# Altium schematic sheet 05_8MPLUS_CFG.SchDoc: 8MPLUS_CFG
size 420 x 297 mm; Author: Lukas Henkel; DocumentNumber: 5; SheetNumber: 5; SheetTotal: 16; DocSize: A3
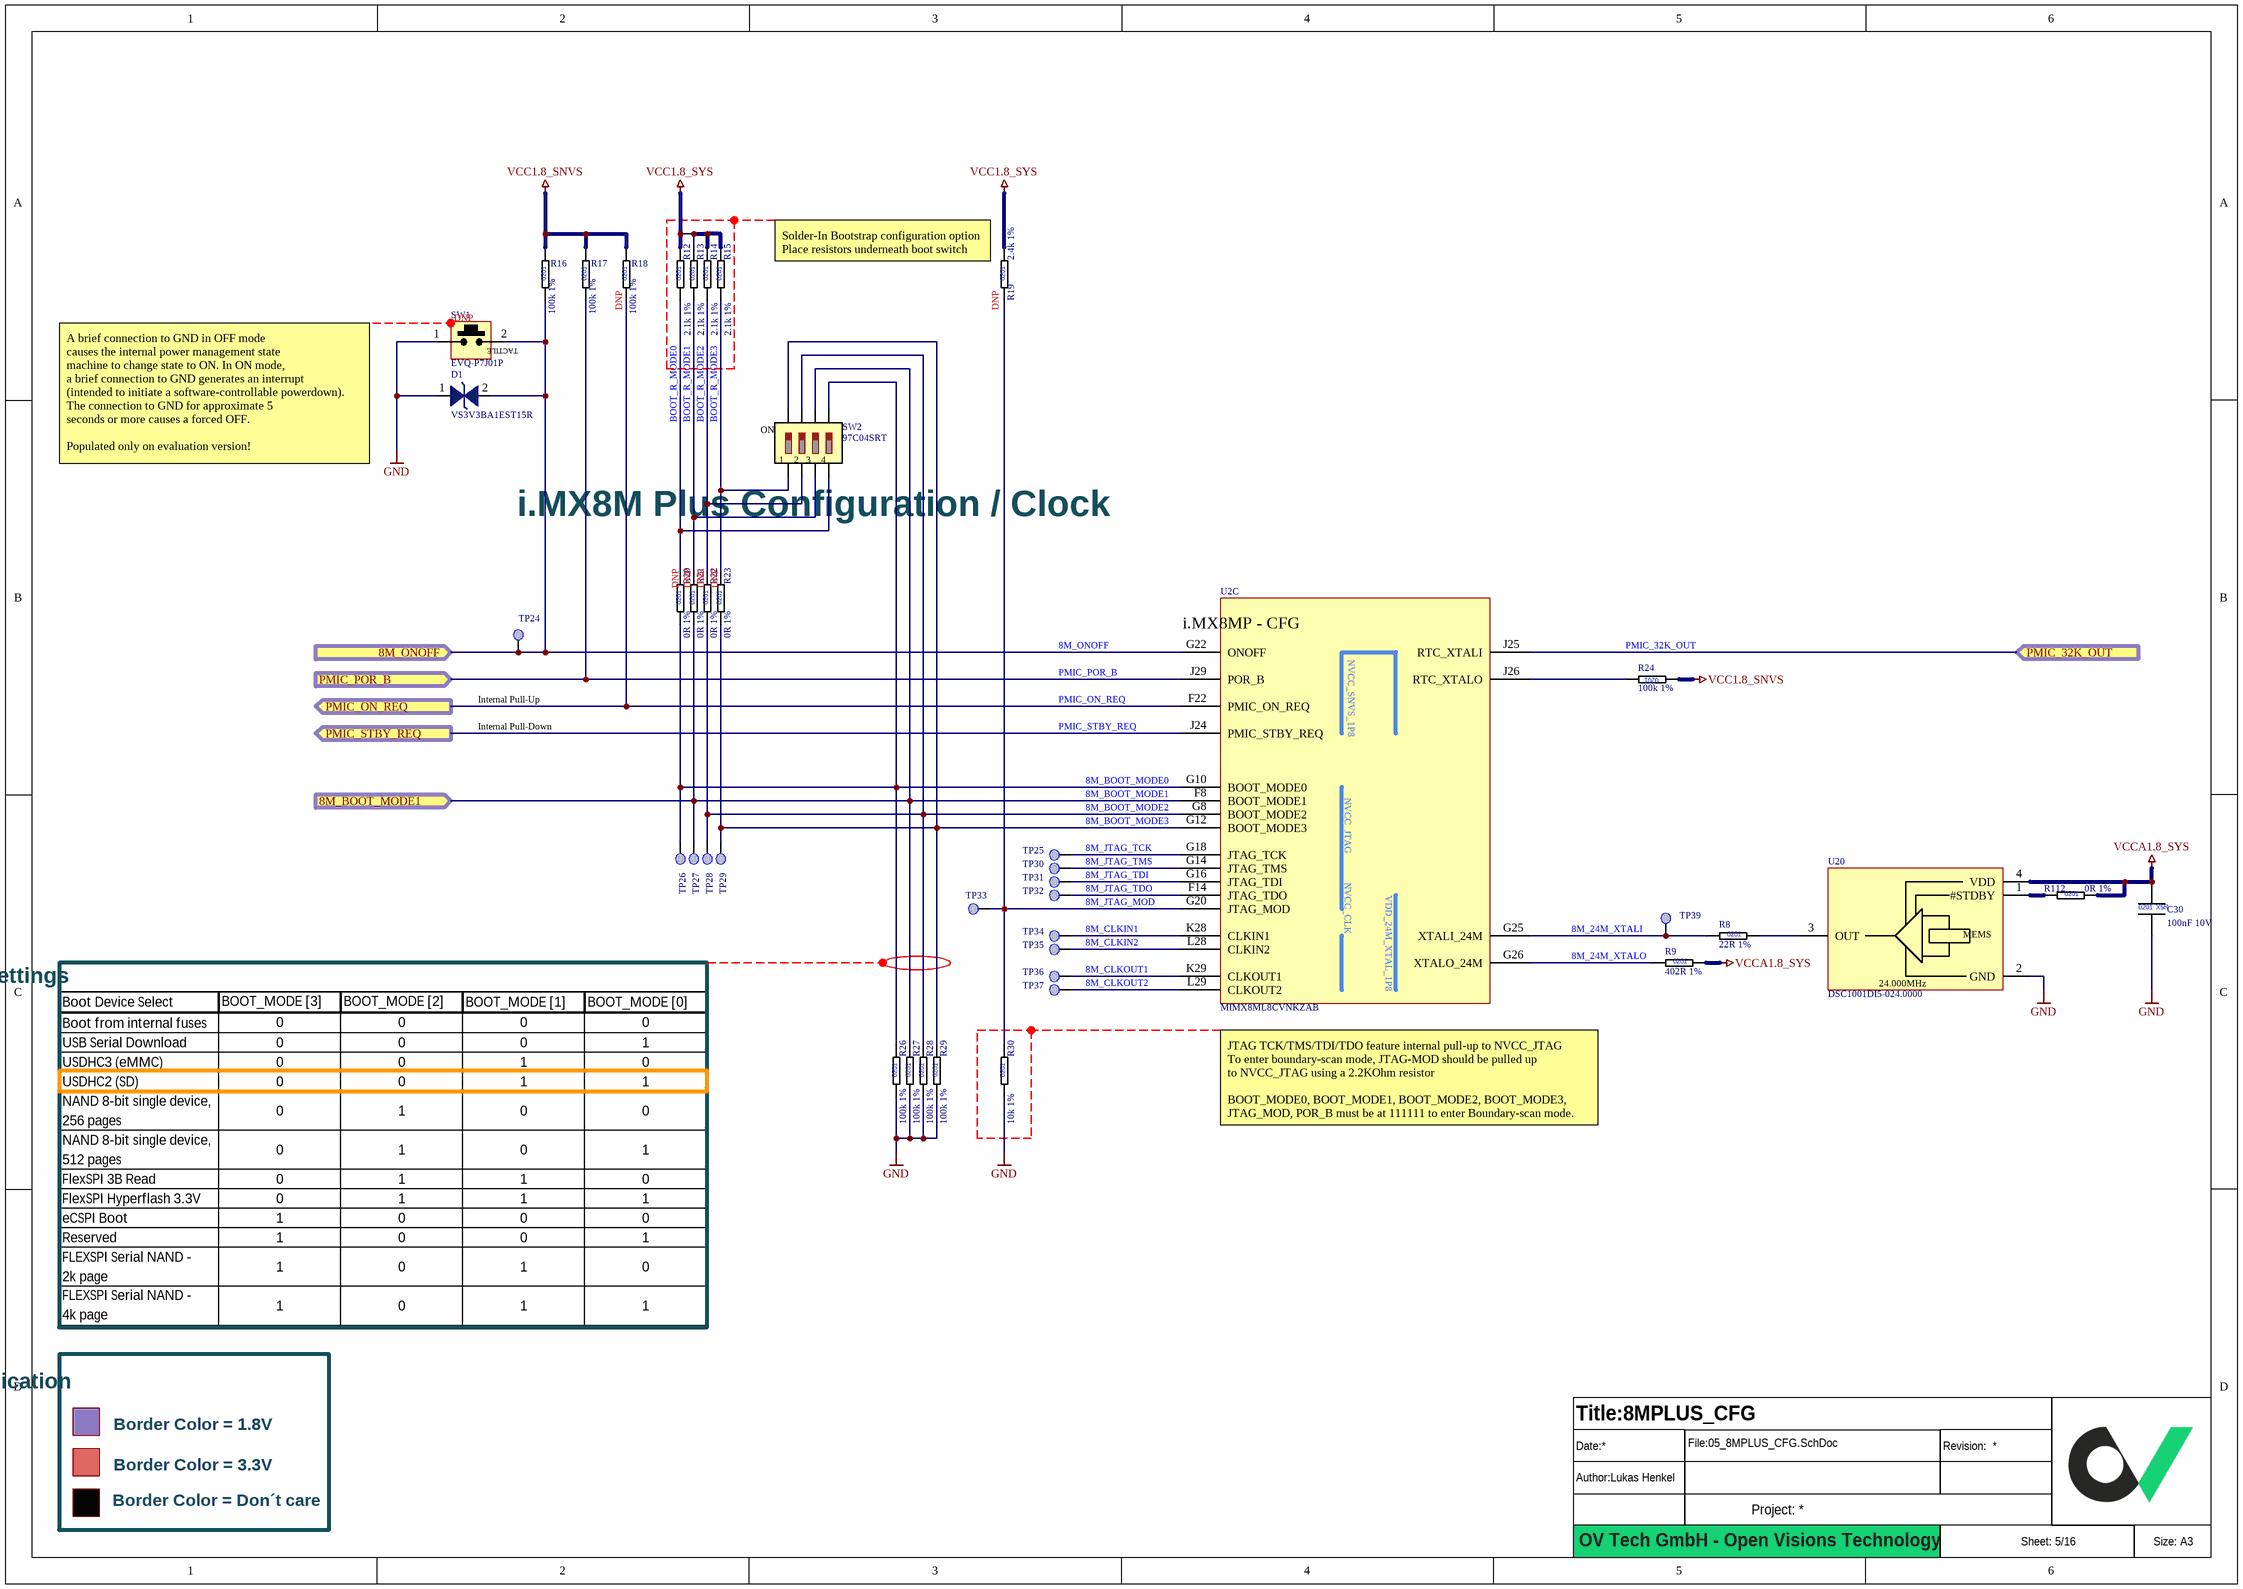
[diagram p0: 05_8MPLUS_CFG.SchDoc]

## Parts
?  (no value)  (graphical)
C30  100nF 10V  [CAPC0603X03L]
D1  VS3V3BA1EST15R  [DFN38P60X29-2L]
R8  22R 1%  [RESC0603X03L]
R9  402R 1%  [RESC0603X03L]
R12  2.1k 1%  [RESC0603X03L]
R13  2.1k 1%  [RESC0603X03L]
R14  2.1k 1%  [RESC0603X03L]
R15  2.1k 1%  [RESC0603X03L]
R16  100k 1%  [RESC0603X03L]
R17  100k 1%  [RESC0603X03L]
R18  100k 1%  [RESC0603X03L]
R19  2.4k 1%  [RESC0603X03L]  (no BOM)
R20  0R 1%  [RESC0603X03L]
R21  0R 1%  [RESC0603X03L]
R22  0R 1%  [RESC0603X03L]
R23  0R 1%  [RESC0603X03L]
R24  100k 1%  [RESC0603X03L]
R26  100k 1%  [RESC0603X03L]
R27  100k 1%  [RESC0603X03L]
R28  100k 1%  [RESC0603X03L]
R29  100k 1%  [RESC0603X03L]
R30  10k 1%  [RESC0603X03L]
R112  0R 1%  [RESC0603X03L]
SW1  EVQ-P7J01P  [SW_TACT_EVQ-P7J01P]
SW2  97C04SRT  [SW_DIP_4POL_97C04SRT]
TP24  Testpoint 0.5mm  [TP_0.50mm]  (value not drawn)  (no BOM)
TP25  Testpoint 0.5mm  [TP_0.50mm]  (value not drawn)  (no BOM)
TP26  Testpoint 0.5mm  [TP_0.50mm]  (value not drawn)  (no BOM)
TP27  Testpoint 0.5mm  [TP_0.50mm]  (value not drawn)  (no BOM)
TP28  Testpoint 0.5mm  [TP_0.50mm]  (value not drawn)  (no BOM)
TP29  Testpoint 0.5mm  [TP_0.50mm]  (value not drawn)  (no BOM)
TP30  Testpoint 0.5mm  [TP_0.50mm]  (value not drawn)  (no BOM)
TP31  Testpoint 0.5mm  [TP_0.50mm]  (value not drawn)  (no BOM)
TP32  Testpoint 0.5mm  [TP_0.50mm]  (value not drawn)  (no BOM)
TP33  Testpoint 0.5mm  [TP_0.50mm]  (value not drawn)  (no BOM)
TP34  Testpoint 0.5mm  [TP_0.50mm]  (value not drawn)  (no BOM)
TP35  Testpoint 0.5mm  [TP_0.50mm]  (value not drawn)  (no BOM)
TP36  Testpoint 0.5mm  [TP_0.50mm]  (value not drawn)  (no BOM)
TP37  Testpoint 0.5mm  [TP_0.50mm]  (value not drawn)  (no BOM)
TP39  Testpoint 0.5mm  [TP_0.50mm]  (value not drawn)  (no BOM)
U2  MIMX8ML8CVNKZAB  [BGA548C50P29X29_1500X1500X148]  (part C of 15)
U20  DSC1001DI5-024.0000  [DFN165P250X90-4N]

## Ports
8M_BOOT_MODE1 (in), 8M_ONOFF (in), PMIC_32K_OUT (in), PMIC_ON_REQ (out), PMIC_POR_B (in), PMIC_STBY_REQ (out)

## Nets
GND: C30.2 D1.1 R26.1 R27.1 R28.1 R29.1 R30.1 SW1.1 U20.2(GND)
VCC1.8_SNVS: R16.2 R17.2 R18.2 R24.1
VCC1.8_SYS: R12.2 R13.2 R14.2 R15.2 R19.2
VCCA1.8_SYS: C30.1 R9.2 R112.2 U20.4(VDD)
8M_24M_XTALI: R8.1 TP39.TP U2.G25(XTALI_24M)
8M_24M_XTALO: R9.1 U2.G26(XTALO_24M)
8M_BOOT_MODE0: R20.1 R26.2 SW2.5 TP26.TP U2.G10(BOOT_MODE0)
8M_BOOT_MODE1: R21.1 R27.2 SW2.6 TP27.TP U2.F8(BOOT_MODE1) ; port 8M_BOOT_MODE1
8M_BOOT_MODE2: R22.1 R28.2 SW2.7 TP28.TP U2.G8(BOOT_MODE2)
8M_BOOT_MODE3: R23.1 R29.2 SW2.8 TP29.TP U2.G12(BOOT_MODE3)
8M_CLKIN1: TP34.TP U2.K28(CLKIN1)
8M_CLKIN2: TP35.TP U2.L28(CLKIN2)
8M_CLKOUT1: TP36.TP U2.K29(CLKOUT1)
8M_CLKOUT2: TP37.TP U2.L29(CLKOUT2)
8M_JTAG_MOD: R19.1 R30.2 TP33.TP U2.G20(JTAG_MOD)
8M_JTAG_TCK: TP25.TP U2.G18(JTAG_TCK)
8M_JTAG_TDI: TP31.TP U2.G16(JTAG_TDI)
8M_JTAG_TDO: TP32.TP U2.F14(JTAG_TDO)
8M_JTAG_TMS: TP30.TP U2.G14(JTAG_TMS)
8M_ONOFF: D1.2 R16.1 SW1.2 TP24.TP U2.G22(ONOFF) ; port 8M_ONOFF
BOOT_R_MODE0: R12.1 R20.2 SW2.4
BOOT_R_MODE1: R13.1 R21.2 SW2.3
BOOT_R_MODE2: R14.1 R22.2 SW2.2
BOOT_R_MODE3: R15.1 R23.2 SW2.1
PMIC_32K_OUT: U2.J25(RTC_XTALI) ; port PMIC_32K_OUT
PMIC_ON_REQ: R18.1 U2.F22(PMIC_ON_REQ) ; port PMIC_ON_REQ
PMIC_POR_B: R17.1 U2.J29(POR_B) ; port PMIC_POR_B
PMIC_STBY_REQ: U2.J24(PMIC_STBY_REQ) ; port PMIC_STBY_REQ
NetR8_2: R8.2 U20.3(OUT)
NetR24_2: R24.2 U2.J26(RTC_XTALO)
NetR112_1: R112.1 U20.1(#STDBY)

## Notes on the sheet
- (near R19) Solder-In Bootstrap configuration option
  Place resistors underneath boot switch
- (near SW1) DNP
- (near R18) DNP
- (near R19) DNP
- A brief connection to GND in OFF mode
  causes the internal power management state
  machine to change state to ON. In ON mode,
  a brief connection to GND generates an interrupt
  (intended to initiate a software-controllable powerdown).
  The connection to GND for approximate 5
  seconds or more causes a forced OFF.
  Populated only on evaluation version!
- i.MX8M Plus Configuration / Clock
- DNP
- Internal Pull-Up
- Internal Pull-Down
- Boot Mode Pin Settings
- (near U2) JTAG TCK/TMS/TDI/TDO feature internal pull-up to NVCC_JTAG
  To enter boundary-scan mode, JTAG-MOD should be pulled up
  to NVCC_JTAG using a 2.2KOhm resistor
  BOOT_MODE0, BOOT_MODE1, BOOT_MODE2, BOOT_MODE3,
  JTAG_MOD, POR_B must be at 111111 to enter Boundary-scan mode.
- Signal Level Indication
- Border Color = 1.8V
- Border Color = 3.3V
- Border Color = Don´t care
- OV Tech GmbH - Open Visions Technology
- (in symbol CAP_0201_100nF_10V) 0201; X5R
- (in symbol MEMS Oscillator_Microchip_DSC1001DI5-024.0000) MEMS; 24.000MHz
- (in symbol RES_0201_0R_1%) 0201
- (in symbol RES_0201_2.1k_1%) 0201
- (in symbol RES_0201_2.4k_1%) 0201
- (in symbol RES_0201_10k_1%) 0201
- (in symbol RES_0201_22R_1%) 0201
- (in symbol RES_0201_100k_1%) 0201
- (in symbol RES_0201_402R_1%) 0201
- (in symbol SoC_i.MX 8M Plus_Quad, part C) i.MX8MP - CFG
- (in symbol SW_DIP_97C04SRT) ON
- (in symbol SW_TACTILE_EVQ-P7J01P) TACTILE

## Library data of the parts
? = Titleblock_01_OpenSource
C30 = CAP_0201_100nF_10V: Multilayer Ceramic Capacitors MLCC - SMD/SMT 0201 10VDC; Manufacturer 1: Murata Electronics; Manufacturer 1 Prt. Nr.: GRT033R61A104KE01J; Manufacturer 2 Prt. Nr.: CL03A104MP3NNNC; Manufacturer 2: Samsung Electro-Mechanics
D1 = ESD Protection Diode_3.3V_VS3V3BA1EST15R: ESD Diode Suppressors Bidirectional 3.3V working voltage 0201; Manufacturer 1: ROHM Semiconductor; Manufacturer 1 Prt. Nr.: VS3V3BA1EST15R
R8 = RES_0201_22R_1%: Thick Film Resistors - SMD 22R OHM 1%; Manufacturer 1: Yageo; Manufacturer 1 Prt. Nr.: RC0201FR-0722RL; Manufacturer 2 Prt. Nr.: CRCW020122R0FNED; Manufacturer 2: Vishay / Dale
R9 = RES_0201_402R_1%: Thick Film Resistors - SMD 402 OHM 1%; Manufacturer 1: Yageo; Manufacturer 1 Prt. Nr.: AC0201FR-07402RL; Manufacturer 2 Prt. Nr.: CRCW0201402RFKED; Manufacturer 2: Vishay / Dale
R12-R15 = RES_0201_2.1k_1%: Thick Film Resistors - SMD 2.1K OHM 1%; Manufacturer 1: Panasonic; Manufacturer 1 Prt. Nr.: ERJ-1GNF2101C; Manufacturer 2 Prt. Nr.: RC0201FR-072K1L; Manufacturer 2: Yageo
R16-R18 R24 R26-R29 = RES_0201_100k_1%: Thick Film Resistors - SMD 100K OHM 1%; Manufacturer 1: Yageo; Manufacturer 1 Prt. Nr.: RC0201FR-07100KL; Manufacturer 2 Prt. Nr.: CRCW0201100KFNED; Manufacturer 2: Vishay / Dale
R19 = RES_0201_2.4k_1%: Thick Film Resistors - SMD 2.4K OHM 1%; Manufacturer 1: Bourns; Manufacturer 1 Prt. Nr.: CR0201AFW-2401GAS; Manufacturer 2 Prt. Nr.: RC0201FR-072K4L; Manufacturer 2: Yageo
R20-R23 R112 = RES_0201_0R_1%: Thick Film Resistors - SMD 0R OHM 1%; Manufacturer 1: Yageo; Manufacturer 1 Prt. Nr.: RC0201FR-070RL; Manufacturer 2 Prt. Nr.: CRCW02010000Z0ED; Manufacturer 2: Vishay / Dale
R30 = RES_0201_10k_1%: Thick Film Resistors - SMD 10K OHM 1%; Manufacturer 1: Yageo; Manufacturer 1 Prt. Nr.: RC0201FR-0710KL; Manufacturer 2 Prt. Nr.: CRCW020110K0FNED; Manufacturer 2: Vishay / Dale
SW1 = SW_TACTILE_EVQ-P7J01P: SMD Switch Tactile SMD 3.2mm X 2.9mm; Manufacturer 1: Panasonic; Manufacturer 1 Prt. Nr.: EVQ-P7J01P
SW2 = SW_DIP_97C04SRT: SMD Switch DIP SMD 1.27mm 4 Pos.; Manufacturer 1: Grayhill Inc.; Manufacturer 1 Prt. Nr.: 97C04SRT; Temperature Range: -40°C - 85°C
U2 = SoC_i.MX 8M Plus_Quad: i.MX 8M Plus Applications Processor  for Industrial Products; Manufacturer 1: NXP Semiconductor; Manufacturer 1 Prt. Nr.: MIMX8ML8CVNKZAB
U20 = MEMS Oscillator_Microchip_DSC1001DI5-024.0000: 1.8V-3.3V Low-Power Precision CMOS Oscillators / Stability: ±10 ppm / Output load: 10pF; Manufacturer 1: Microchip Technology; Manufacturer 1 Prt. Nr.: DSC1001DI5-024.0000